# EAGLE design MQTTDoorBell (EAGLE 9.3.0)
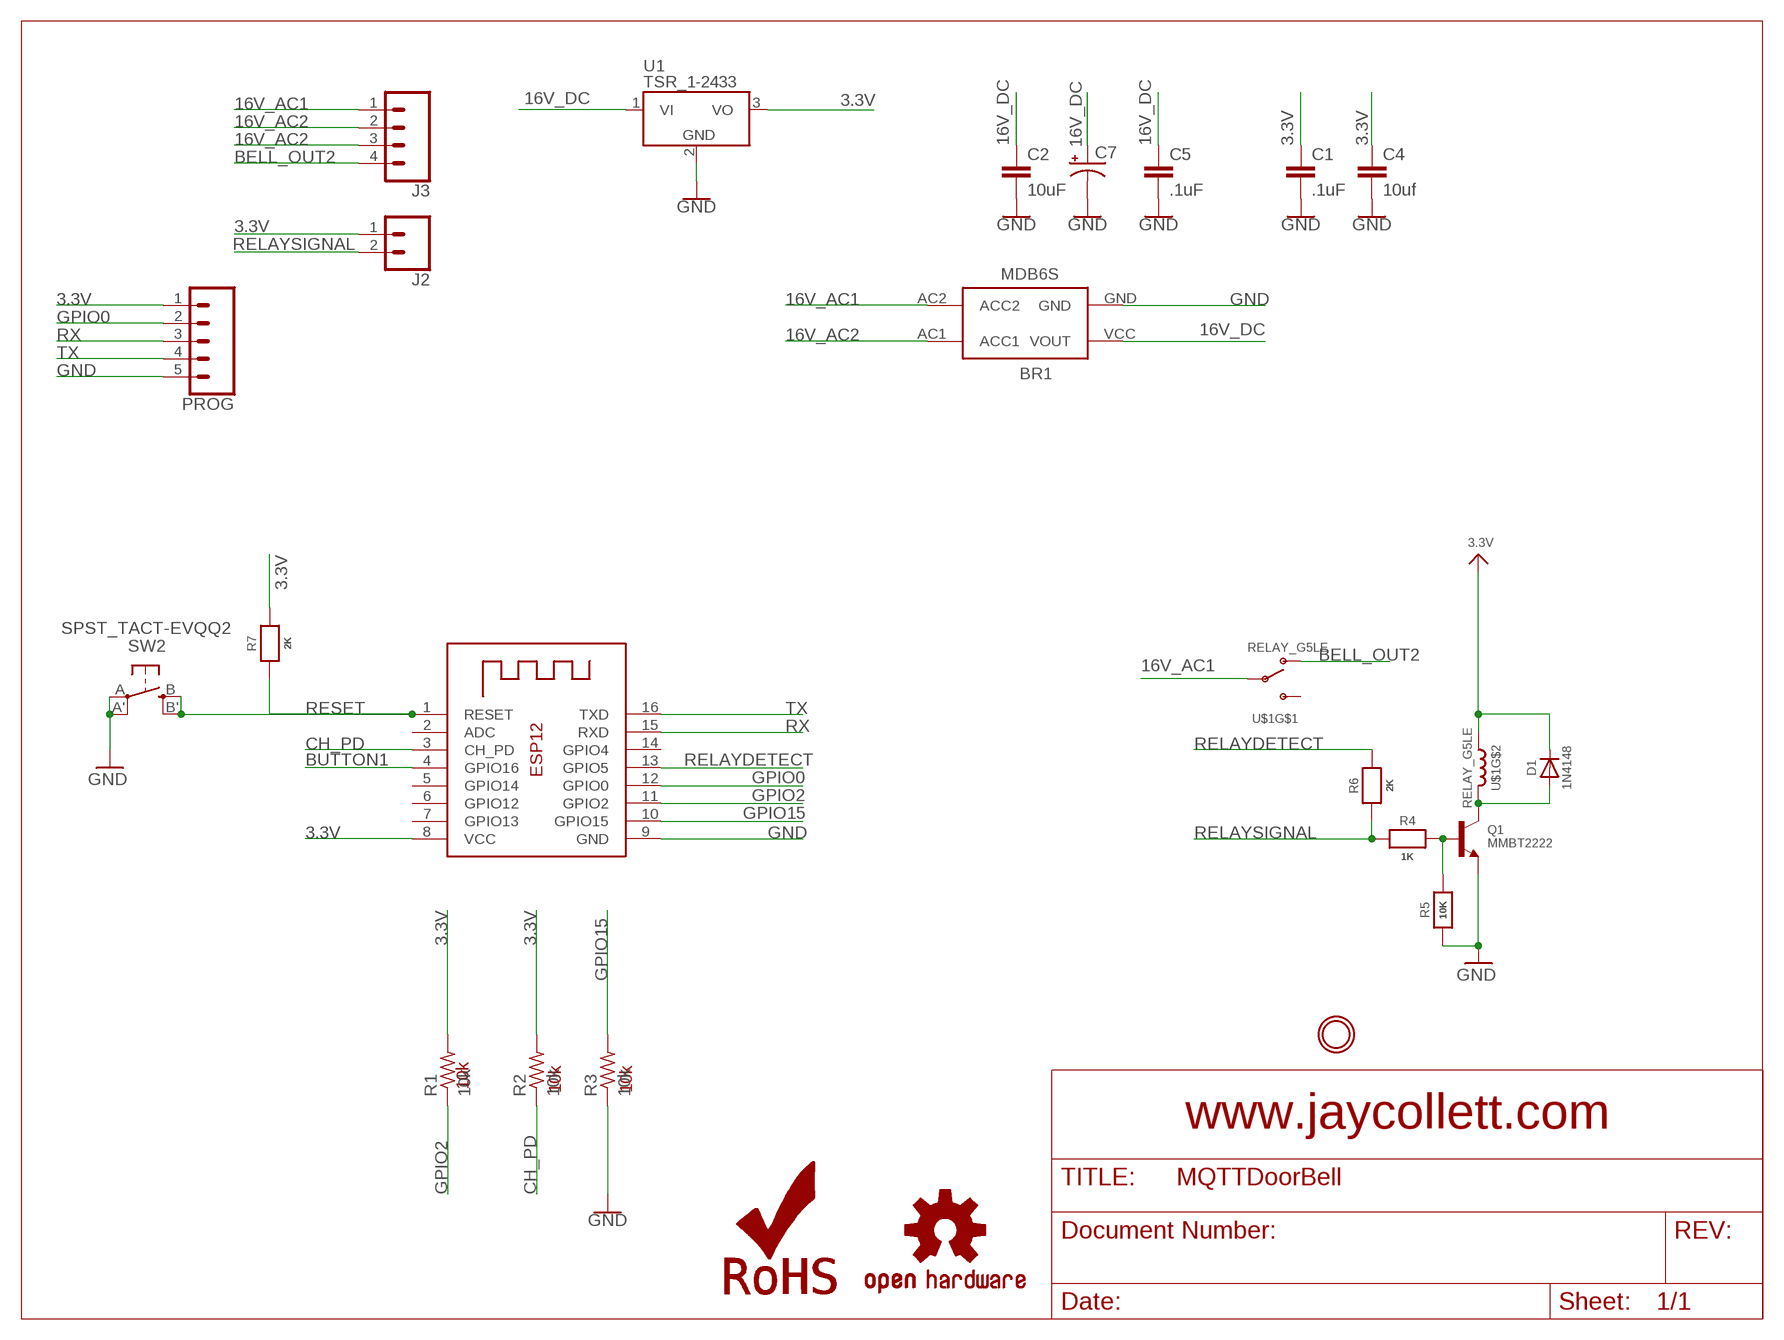
[diagram p0: schematic, sheet 1]

## Parts
BR1  MDB6S  [MICRO-DIP]
C1  .1uF  10UF-0805-10V-10%  [0805]
C2  10uF  10UF-0805-10V-10%  [0805]
C4  10uf  10UF-0805-10V-10%  [0805]
C5  .1uF  10UF-0805-10V-10%  [0805]
C7  CPOL-USE5-10.5  [E5-10,5]
D1  1N4148  DIODESOD-323  [SOD-323]
J2  CONN_023.5MM  [SCREWTERMINAL-3.5MM-2]
J3  CONN_04SCREW  [SCREWTERMINAL-3.5MM-4]
LOGO1  OSHW-LOGOMINI  [OSHW-LOGO-MINI]
LOGO2  ROHS_LOGO  [ROHS_LOGO_0.18_IN]
PROG  CONN_05  [1X05]
Q1  MMBT2222  TRANSISTOR_NPN  [SOT23-R]
R1  10k  R-US_M0805  [M0805]
R2  10k  R-US_M0805  [M0805]
R3  10k  R-US_M0805  [M0805]
R4  1K  RESISTOR0805_NOOUTLINE  [0805-NO]
R5  10K  RESISTOR0805_NOOUTLINE  [0805-NO]
R6  2K  RESISTOR0805_NOOUTLINE  [0805-NO]
R7  2K  RESISTOR0805_NOOUTLINE  [0805-NO]
SW2  SPST_TACT-EVQQ2  [EVQ-Q2]
U1  TSR_1-2433  [TSR-1]
U$1  RELAY_G5LE  [RELAY_G5LE-1]
U$4  MICROBUILDER_MOUNTINGHOLE3.0THIN  [MICROBUILDER_MOUNTINGHOLE_3.0_PLATEDTHIN]
X1  ESP-12  [ESP-12]

## Nets
3.3V [3.3V]: C1.1 C4.1 D1.C J2.1 PROG.1 R1.2 R2.2 R7.2 U1.3(VO) U$1.2 X1.8(VCC)
16V_AC1 [ACPWR]: BR1.AC2(ACC2) J3.1 U$1.1(P)
16V_AC2 [ACPWR]: BR1.AC1(ACC1) J3.2 J3.3
16V_DC [16VCDPWR]: BR1.VCC(VOUT) C2.1 C5.1 C7.+ U1.1(VI)
BELL_OUT2 [ACPWR]: J3.4 U$1.3(O)
BUTTON1: X1.4(GPIO16)
CH_PD: R2.1 X1.3(CH_PD)
GND: BR1.GND C1.2 C2.2 C4.2 C5.2 C7.- PROG.5 Q1.2(E) R3.1 R5.1 SW2.A'(P1) SW2.A(P) U1.2(GND) X1.9(GND)
GPIO0: PROG.2 X1.12(GPIO0)
GPIO2: R1.1 X1.11(GPIO2)
GPIO15: R3.2 X1.10(GPIO15)
N$4: D1.A Q1.3(C) U$1.5
N$22: Q1.1(B) R4.2 R5.2
RELAYDETECT: R6.2 X1.13(GPIO5)
RELAYSIGNAL: J2.2 R4.1 R6.1
RESET: R7.1 SW2.B'(S1) SW2.B(S) X1.1(RESET)
RX: PROG.3 X1.15(RXD)
TX: PROG.4 X1.16(TXD)
Unconnected: U$1.4(S) X1.2(ADC) X1.5(GPIO14) X1.6(GPIO12) X1.7(GPIO13) X1.14(GPIO4)

## Notes on the sheet
- 10k | 10k | 10k
- www.jaycollett.com

## Library data of the parts
BR1 = JayCollett:MDB6S: MDB6S <https://www.onsemi.com/pub/Collateral/MDB8S-D.pdf> - Single-Phase Bridge Rectifier Specifications: Manufacturer: ON Semiconductor Manufacturer PN: MDB6S <https://www.onsemi.com/pub/Collateral/MDB8S-D.pdf> Operating Temperature: -55C ~ 150C (TJ) Diode Type: Single Phase Voltage - Peak Reverse (MAX): 600V Current - Average Rectified (lo): 1A Mounting Type: SMD (4-MicroDIP/SMD)
C1 C4 C5 = SparkFun-Capacitors:10UF: 10.0µF ceramic capacitors A capacitor is a passive two-terminal electrical component used to store electrical energy temporarily in an electric field.; PROD_ID: CAP-11330; VALUE: 10uF
C2 = SparkFun-Capacitors:10UF: 10.0µF ceramic capacitors A capacitor is a passive two-terminal electrical component used to store electrical energy temporarily in an electric field.; PROD_ID: CAP-11330
C7 = adafruit:CPOL-US: POLARIZED CAPACITOR, American symbol
D1 = microbuilder:DIODE: Diode SMA Model Volts Amps Type Vf Ir Digikey # Notes SSA34-E3 40V 3A Schottky 480mV @ 3A 200uA @ 40V SSA34-E3/61TGITR-ND CDBA120-G 20V 1A Schottky 500mV @ 1A 500uA @ 20V 641-1014-6-ND REEL MBRA210 10V 2A Schottky 350mV @ 2A 700uA @ 10V MBRA210LT3 SOD-123 Model Volts Amps Type Vf Ir Order # Notes BAT54T1G 30V 200mA Schottky 800mV @ 200mA 2uA @ 25V BAT54T1GOSTR-ND B0530W 30V 500mA Schottky 430mV @ 500mA 130uA @ 30V B0530W-FDICT-ND REEL MBR120 20V 1A Schottky 340mV @ 1A MBR120VLSFT1GOSCT-ND SOD-323 Model Volts Amps Type Vf Ir Order # Notes PMEG2005EJ 20V 500mA Schottky 355mV @ 500mA 568-4110-1-ND ZLLS410 10V 570mA Schottky 380mV @ 570mA ZLLS410CT-ND 1N4148WS 75V 150mA Silicon/Simple 1V 1N4148WSFSCT-ND REEL SOD-523 Model Volts Amps Type Vf Ir Order # Notes BAT54XV2 30V 200mA Schottky 0.8V @ 100mA BAT54XV2CT-ND TB751S 30V 30mA Schottky RB751S-40TE61CT-ND SOT23-R/W (R = Solder Paste/Reflow Ovens, W = Hand-Soldering) Model Volts Amps Type Vf Ir Order # Notes BAT54FILM 40V 300mA Schottky 497-7162-1-ND POWERDI-5 Model Volts Amps Type Vf Ir Order # Notes PDS560 60V 5A Schottky 670mV @ 5A 150uA @ 60V PDS560DICT-ND
J2 = SparkFun-Connectors:CONN_02: Multi connection point. Often used as Generic Header-pin footprint for 0.1 inch spaced/style header connections On any of the 0.1 inch spaced packages, you can populate with these: Break Away Headers - Straight <https://www.sparkfun.com/products/116> (PRT-00116) Break Away Male Headers - Right Angle <https://www.sparkfun.com/products/553> (PRT-00553) Female Headers <https://www.sparkfun.com/products/115> (PRT-00115) Break Away Headers - Machine Pin <https://www.sparkfun.com/products/117> (PRT-00117) Break Away Female Headers - Swiss Machine Pin <https://www.sparkfun.com/products/743> (PRT-00743) For SCREWTERMINALS and SPRING TERMINALS visit here: Screw Terimnals on SparkFun.com <https://www.sparkfun.com/search/results?term=Screw+Terminals> (5mm/3.5mm/2.54mm spacing) This device is also useful as a general connection point to wire up your design to another part of your project. Our various solder wires solder well into these plated through hole pads. Hook-Up Wire - Assortment (Stranded, 22 AWG) <https://www.sparkfun.com/products/11375> (PRT-11375) Hook-Up Wire - Assortment (Solid Core, 22 AWG) <https://www.sparkfun.com/products/11367> (PRT-11367) View the entire wire category on our website here <https://www.sparkfun.com/categories/141> Special notes: Molex polarized connector foot print use with: PRT-08233 with associated crimp pins and housings. 2.54_SCREWTERM for use with PRT-10571. 3.5mm Screw Terminal footprints for PRT-08084 5mm Screw Terminal footprints for use with PRT-08432; PROD_ID: CONN-08399
J3 = SparkFun-Connectors:CONN_04: Multi connection point. Often used as Generic Header-pin footprint for 0.1 inch spaced/style header connections On any of the 0.1 inch spaced packages, you can populate with these: Break Away Headers - Straight <https://www.sparkfun.com/products/116> (PRT-00116) Break Away Male Headers - Right Angle <https://www.sparkfun.com/products/553> (PRT-00553) Female Headers <https://www.sparkfun.com/products/115> (PRT-00115) Break Away Headers - Machine Pin <https://www.sparkfun.com/products/117> (PRT-00117) Break Away Female Headers - Swiss Machine Pin <https://www.sparkfun.com/products/743> (PRT-00743) For SCREWTERMINALS and SPRING TERMINALS visit here: Screw Terimnals on SparkFun.com <https://www.sparkfun.com/search/results?term=Screw+Terminals> (5mm/3.5mm/2.54mm spacing) This device is also useful as a general connection point to wire up your design to another part of your project. Our various solder wires solder well into these plated through hole pads. Hook-Up Wire - Assortment (Stranded, 22 AWG) <https://www.sparkfun.com/products/11375> (PRT-11375) Hook-Up Wire - Assortment (Solid Core, 22 AWG) <https://www.sparkfun.com/products/11367> (PRT-11367) View the entire wire category on our website here <https://www.sparkfun.com/categories/141> Special notes: Molex polarized connector foot print use with SKU : PRT-08231 with associated crimp pins and housings. 1MM SMD Version SKU: PRT-10208; PROD_ID: 2xCONN-08399; SF_ID: 2xPRT-08084
LOGO1 = SparkFun-Aesthetics:OSHW-LOGO: Open-Source Hardware (OSHW) Logo This logo indicates the piece of hardware it is found on incorporates a OSHW license and/or adheres to the definition of open source hardware found here: http://freedomdefined.org/OSHW
LOGO2 = SparkFun-Aesthetics:ROHS_LOGO: Restriction of Hazardous Substances (RoHS) Logo Logo for RoHS-certified hardware.
PROG = SparkFun-Connectors:CONN_05: Multi connection point. Often used as Generic Header-pin footprint for 0.1 inch spaced/style header connections On any of the 0.1 inch spaced packages, you can populate with these: Break Away Headers - Straight <https://www.sparkfun.com/products/116> (PRT-00116) Break Away Male Headers - Right Angle <https://www.sparkfun.com/products/553> (PRT-00553) Female Headers <https://www.sparkfun.com/products/115> (PRT-00115) Break Away Headers - Machine Pin <https://www.sparkfun.com/products/117> (PRT-00117) Break Away Female Headers - Swiss Machine Pin <https://www.sparkfun.com/products/743> (PRT-00743) For SCREWTERMINALS and SPRING TERMINALS visit here: Screw Terimnals on SparkFun.com <https://www.sparkfun.com/search/results?term=Screw+Terminals> (5mm/3.5mm/2.54mm spacing) This device is also useful as a general connection point to wire up your design to another part of your project. Our various solder wires solder well into these plated through hole pads. Hook-Up Wire - Assortment (Stranded, 22 AWG) <https://www.sparkfun.com/products/11375> (PRT-11375) Hook-Up Wire - Assortment (Solid Core, 22 AWG) <https://www.sparkfun.com/products/11367> (PRT-11367) View the entire wire category on our website here <https://www.sparkfun.com/categories/141> Special notes: Molex polarized connector foot print use with SKU : PRT-08231 with associated crimp pins and housings. 1MM SMD Version SKU: PRT-10208
Q1 = microbuilder:TRANSISTOR_NPN: NPN Transistor Transistor (NPN) 500mA 45V - BC817 [Digikey: 568-1631-1-ND] Transistor (NPN) 500mA 45V - BC817,215 [Mouser: 771-BC817-T/R] SOT23-R - SOT23 footprint optimised for use with solder paste and reflow ovens. SOT23-W - SOT23 footprint optimised for hand-soldering (larger pads).
R1-R3 = adafruit:R-US_: RESISTOR, American symbol
R4-R7 = microbuilder:RESISTOR: Resistors For new designs, use the packages preceded by an '_' character since they are more reliable: The following footprints should be used on most boards: _0402 - Standard footprint for regular board layouts _0603 - Standard footprint for regular board layouts _0805 - Standard footprint for regular board layouts _1206 - Standard footprint for regular board layouts For extremely tight-pitch boards where space is at a premium, the following 'micro-pitch' footprints can be used (smaller pads, no silkscreen outline, etc.): _0402MP - Micro-pitch footprint for very dense/compact boards _0603MP - Micro-pitch footprint for very dense/compact boards _0805MP - Micro-pitch footprint for very dense/compact boards _1206MP - Micro-pitch footprint for very dense/compact boards
SW2 = adafruit:SPST_TACT: SMT 6mm switch, EVQQ2 series http://www.ladyada.net/library/eagle
U1 = Traco_TSR:TSR_1-*: TRACO TSR-1 Series Point-of-Load DC/DC-Converters Vi max. 36 V; Vo = (1.2 .. 15)V ±2%; Io = 0 .. 1 A SIP-Package (drop-in replacement for 78xx linear voltage regulators in TO220-package, vertically assembled) Source: www.tracopower.com Technologies: TSR 1- Vi (V) Vo (V) ±2% Io = 0 .. 1 A 24_ ( generic ) 2412 4.6 .. 36 1.2 2415 4.6 .. 36 1.5 2418 4.6 .. 36 1.8 2425 4.6 .. 36 2.5 2433 4.75.. 36 3.3 2450 6.5 .. 36 5.0 2465 9.0 .. 36 6.5 2490 12 .. 36 9.0 24120 15 .. 36 12 24150 18 .. 36 15 Author: Dipl.-Ing. FH Rainer Bayer HHN Hochschule Heilbronn, rainer.bayer@hs-heilbronn.de Ingenieurbüro ing-rb, mail@ing-rb.de
U$1 = microbuilder:RELAY_G5LE; SPICEPREFIX: B
U$4 = microbuilder:MICROBUILDER_MOUNTINGHOLE: Mounting Hole For #2 screws (0.086"/2.18mm width, 0.094"/2.4mm hole) use 2.5mm
X1 = adafruit:ESP-12

## Net classes
1 3.3V: width 0.406 mm, clearance 0.203 mm to class 0
2 ACPWR: width 0.61 mm, clearance 0.305 mm to class 0
3 16VCDPWR: width 0.356 mm, clearance 0.203 mm to class 0

## Board
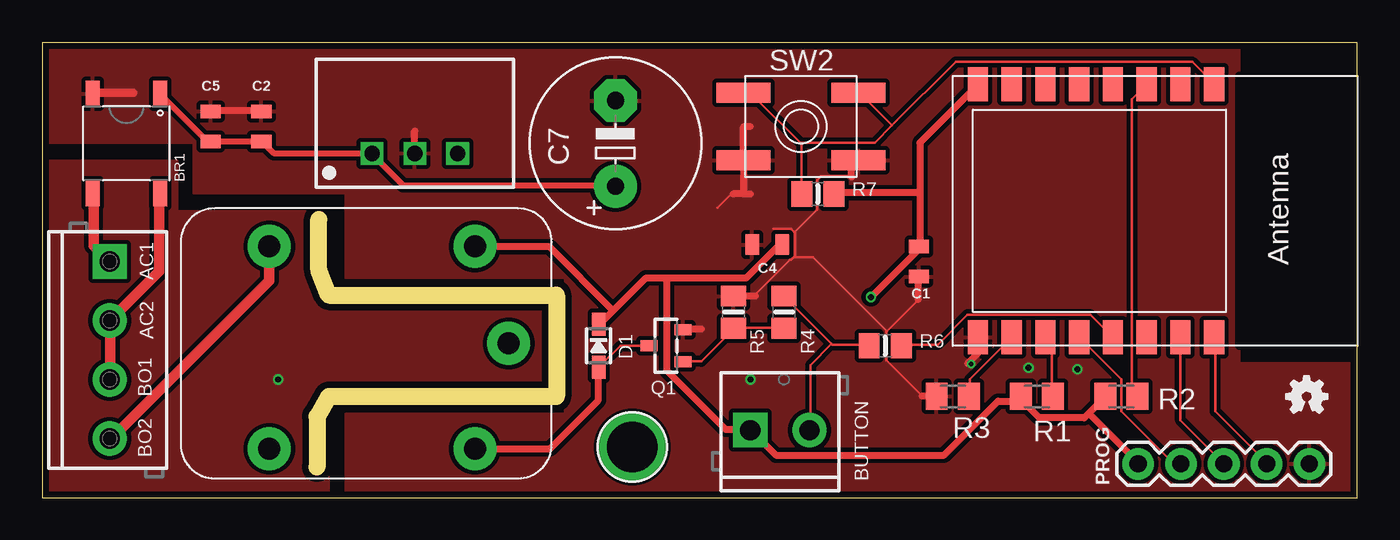
[diagram p1: board, top side]
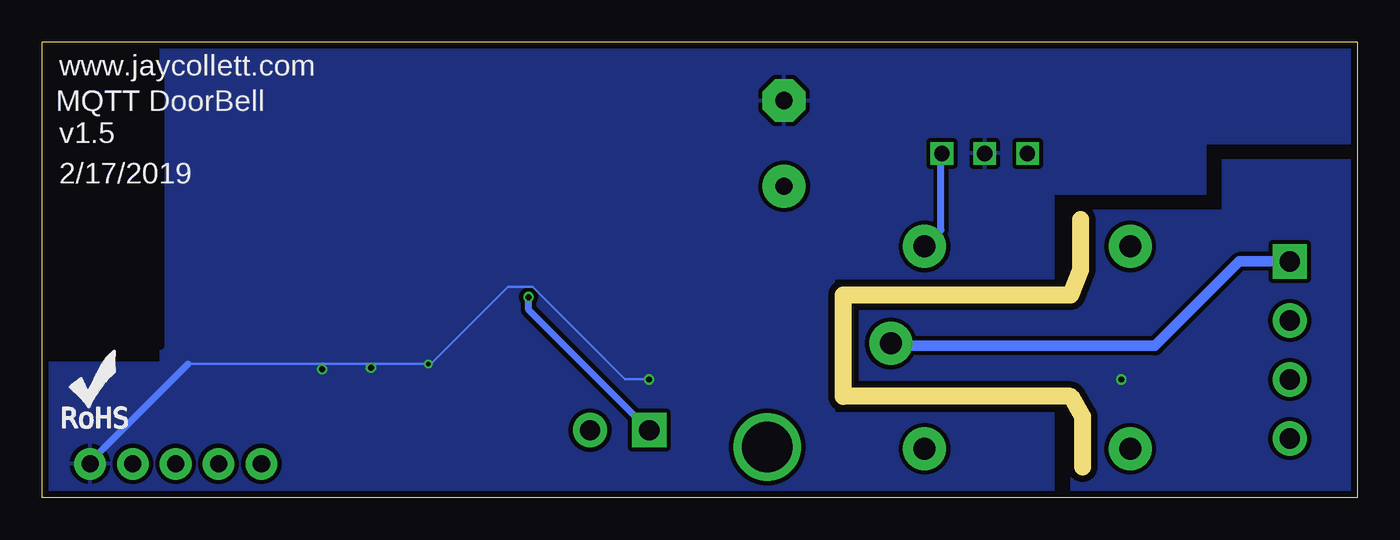
[diagram p2: board, bottom side, seen from below]

Size 78 x 27 mm. Coordinates in mm from the lower left corner, seen from the top.
Outline: 16.4,16.5 16.4,13.5 17,12 30.5,12 30.5,6 17,6 16.3,4.8 16.3,1.8
Outline: 0,0 78,0 78,27 0,27 0,0
Copper layers (1*16): Top 0.035559375mm / dielectric 1.6mm / Bottom 0.035559375mm
Design rules "default": minimum track width 6mil, minimum drill 10mil, track to track 6mil, track to pad 6mil, pad to pad 6mil, via to via 6mil, smd to smd 6mil, copper to edge 15mil, drill to drill 6mil, minimum pad ring 5mil, minimum via ring 5mil, stop-mask expansion 2.5mil, vias tented up to drill 20mil, thermal gap 10mil

### Footprints (pad centres in the part's own frame; a part is rotated, then mirrored left to right if it is on the bottom)
MICRO-DIP = smd 0.85 x 1.55: AC1 -2,2.95; AC2 2,2.95; GND 2,-2.95; VCC -2,-2.95
0805 = smd 0.8 x 1.2: 1 -0.9,0; 2 0.9,0
E5-10,5 = drill 1.016 pad 2.54: + -2.54,0 | drill 1.016 pad 2.54 octagon: - 2.54,0
SOD-323 = smd 1.35 x 0.8: A 1.27,0; C -1.27,0
SCREWTERMINAL-3.5MM-2 = drill 1.2 pad 2.032 square: 1 0,0 | drill 1.2 pad 2.032: 2 3.5,0
SCREWTERMINAL-3.5MM-4 = drill 1.2 pad 2.032 square: 1 0,0 | drill 1.2 pad 2.032: 2 3.5,0; 3 7,0; 4 10.5,0
1X05 = drill 1.016 pad 1.88: 1 0,0; 2 2.54,0; 3 5.08,0; 4 7.62,0; 5 10.16,0
SOT23-R = smd 0.635 x 1.016: 1 -0.95,-1; 2 0.95,-1; 3 0,1
M0805 = smd 1.3 x 1.6: 1 -0.95,0; 2 0.95,0
0805-NO = smd 1.24 x 1.5: 1 -0.95,0; 2 0.95,0
EVQ-Q2 = smd 3.2 x 1.2: A -3.4,-2; A' 3.4,-2; B -3.4,2; B' 3.4,2
TSR-1 = drill 0.9 square: 1 -2.54,0; 2 0,0; 3 2.54,0
RELAY_G5LE-1 = drill 1.3 pad 2.54: 1 -8.35,0; 2 -6.35,-5.75; 3 5.85,-5.75; 4 5.85,6.25; 5 -6.35,6.25
MICROBUILDER_MOUNTINGHOLE_3.0_PLATEDTHIN = drill 3 pad 3.6: P$1 0,0
ESP-12 = smd 2 x 1.2: 1 -7.5,4.5; 2 -7.5,2.5; 3 -7.5,0.5; 4 -7.5,-1.5; 5 -7.5,-3.5; 6 -7.5,-5.5; 7 -7.5,-7.5; 8 -7.5,-9.5; 9 7.5,-9.5; 10 7.5,-7.5; 11 7.5,-5.5; 12 7.5,-3.5; 13 7.5,-1.5; 14 7.5,0.5; 15 7.5,2.5; 16 7.5,4.5

### Placement (x,y rotation side)
BR1  5,21 180 top
C1  52,14 270 top
C2  13,22 90 top
C4  43,15 180 top
C5  10,22 90 top
C7  34,21 90 top
D1  33,9 270 top
J2  42,4 0 top
J3  4,14 270 top
LOGO1  75,6 0 top
LOGO2  77,4 0 bottom
PROG  65,2 0 top
Q1  37,9 90 top
R1  59,6 180 top
R2  64,6 180 top
R3  54,6 0 top
R4  44,11 270 top
R5  41,11 270 top
R6  50,9 0 top
R7  46,18 0 top
SW2  45,22 0 top
U1  22.1,20.4 0 top
U$1  19.32,9.14 180 top
U$4  35,3 0 top
X1  65,17 270 top

### Tracks (layer width: path | path; a pad name or v marks a point on that pad's centre or on a via)
3.3V  (via drill 0.35)
  Top 0.406: 62.06,4.99 63.02,5.94 R2.2 | 62.06,4.99 61.8,4.72 59.13,4.72 58.06,5.79 58.06,5.94 R1.2 57.91,5.71 56.69,5.71 53.49,2.52 43.51,2.52 42.14,3.89 J2.1 41.99,4.04 40.54,4.04 37.03,7.54 37.03,13.03 | 62.06,4.99 65,2.06 PROG.1 | 52.05,18.06 52.05,21.03 55.47,24.46 X1.8 | 52.05,18.06 52.05,14.94 C1.1 51.97,14.71 v49.15,11.89 | 37.03,13.03 35.81,13.03 33.87,11.09 | 37.03,13.03 41.76,13.03 43.66,14.94 43.89,14.94 C4.1 | 33.87,11.09 33.07,10.29 D1.C | 33.87,11.09 30.1,14.86 25.68,14.86 U$1.2 | 52.05,18.06 47.02,18.06 R7.2
  Bottom 0.406: U1.3 24.69,20.34 24.69,15.85 25.6,14.94 U$1.2 | v49.15,11.89 49.15,11.12 42.06,4.04 J2.1
16V_AC1
  Top 0.61: BR1.AC2 3.05,17.98 3.05,14.94 3.96,14.02 J3.1
  Bottom 0.61: J3.1 7,14 12,9 27.53,9 U$1.1
16V_AC2
  Top 0.61: BR1.AC1 6.93,17.98 6.93,13.41 4.04,10.52 J3.2 4.04,10.21 4.04,7.01 J3.3
16V_DC
  Top 0.356: BR1.VCC 7.01,23.93 9.83,21.11 C5.1 10.06,21.11 12.95,21.11 C2.1 13.11,21.03 13.72,20.42 19.51,20.42 U1.1 19.66,20.27 21.41,18.52 33.98,18.52 C7.+
ACISO1  (via drill 0.35)
  other vias: 14,7
  pour Top (isolate 0.254): 0,20 8,20 8,17 17,17 17,12 30,12 30,6 17,6 17,0 0,0
  pour Bottom (isolate 0.254): 0,20 8,20 8,17 17,17 17,12 30,12 30,6 17,6 17,0 0,0
BELL_OUT2
  Top 0.61: J3.4 4.04,3.43 13.47,12.86 U$1.3
CH_PD
  Top 0.152: R2.1 64.92,6.02 64.92,6.15 64.62,6.46 64.62,23.62 65.46,24.46 X1.3
GND  (via drill 0.25, 0.35)
  Top 0.152: 10.06,22.94 C5.2 9.98,22.94 | 12.95,22.94 C2.2 13.03,22.86 | 38.02,9.98 Q1.2 | 41,11.89 R5.1 41.07,11.96 | 42.44,15.01 42.14,15.01 C4.2 42.14,15.09 | 43.36,15.93 44.42,15.93 44.62,15.73 | 44.62,15.73 44.65,15.7 44.65,14.33 44.62,14.29 | 50.1,9.87 50.06,9.83 50.06,8.15 52.2,6.02 | 50.1,9.87 51.97,11.73 | 51.97,13.03 C1.2 | 53.03,6.02 R3.1 | 55.47,8.53 55.47,9.45 X1.9 | 53.03,6.1 R3.1 | 54.94,7.92 54.9,7.96 | 50.1,9.87 45.72,14.25 44.65,14.25 44.62,14.29 | 34.06,23.16 34.06,23.47 C7.- | 53.11,6.17 R3.1 | 40.04,17.18 40.84,17.98 41,18 | 44.62,14.29 44.42,14.1 44.35,14.1 42.37,12.12 42.29,11.96 | 48,19.05 46.18,19.05 45.95,18.82 45.95,17.07 44.62,15.73 | v55.09,7.92 54.98,8.04
  Top 0.406: 12.95,22.94 10.06,22.94 | 22.1,20.73 U1.2 22.1,21.74 | 39.09,9.98 38.02,9.98 | 41.07,11.96 42.29,11.96 | 51.97,11.73 51.97,13.03 | 53.03,6.02 52.2,6.02 | 54.9,7.96 54.98,8.04 55.47,8.53 | 34.06,23.09 C7.- | 41.6,18 41,18 | 41.6,18 42,18 | 42,22 41.6,22 SW2.A 41.6,18 | 48,19 48,19.05 48,20 SW2.A'
  Top 0.508: 5.41,24 3.05,24 BR1.GND
  Bottom 0.152: 69.35,7.92 v55.09,7.92 54.94,7.92 50.37,12.5 48.92,12.5 43.43,7.01 42.06,7.01 v42,7 | 75.13,2.06 PROG.5
  Bottom 0.406: 75.13,2.06 75.22,2.06 69.35,7.92
  other vias: 58.5,7.7 61.4,7.6
  pour Top (isolate 0.254): 0,27 71,27 71,8 78,8 78,0 18,0 18,5 31,5 31,13 18,13 18,18 9,18 9,21 0,21
  pour Bottom (isolate 0.254): 0,27 71,27 71,8 78,8 78,0 18,0 18,5 31,5 31,13 18,13 18,18 9,18 9,21 0,21
GPIO0
  Top 0.152: X1.12 61.57,9.45 64.01,7.01 64.01,5.11 67.06,2.06 67.51,2.06 PROG.2
GPIO2
  Top 0.152: R1.1 59.89,6.02 59.89,9.07 59.51,9.45 X1.11
GPIO15
  Top 0.152: R3.2 55.02,6.02 55.02,7.01 57.45,9.45 X1.10
N$4
  Top 0.152: Q1.3 35.97,8.99 34.29,8.99 33.07,7.77 D1.A 32.99,7.7 | U$1.5
  Top 0.406: 32.99,7.7 32.99,5.77 30.12,2.9 U$1.5
N$22
  Top 0.152: Q1.1 38.02,8.08 39.09,8.08 41,9.98 R5.2 41.07,10.06 43.97,10.06 R4.2
RELAYDETECT
  Top 0.152: R6.2 50.98,9.07 53.11,9.07 54.89,10.84 62.16,10.84 63.48,9.53 X1.13
RELAYSIGNAL
  Top 0.152: 46.83,9.11 44.04,11.89 R4.1 | 46.83,9.11 46.86,9.07 49,9.07 R6.1 | 46.83,9.11 45.57,7.85 45.57,4.04 J2.2
RESET
  Top 0.152: 45,20.99 42.06,23.93 41.6,23.93 SW2.B | 45,20.99 45.03,20.95 45.03,18.06 R7.1 | 50.41,22.06 49.38,21.03 45.03,21.03 45,20.99 | 50.41,22.06 54.18,25.83 68.2,25.83 69.49,24.54 X1.1 | 50.41,22.06 48.46,24 SW2.B'
RX
  Top 0.152: X1.15 67.51,9.45 67.51,4.57 70.03,2.06 PROG.3
TX
  Top 0.152: X1.16 69.57,9.45 69.57,5.11 72.62,2.06 PROG.4

### Text on the board
tPlace: AC1 | AC2 | BO1 | BO2 | BUTTON
bPlace: www.jaycollett.com | MQTT DoorBell | v1.5 | 2/17/2019